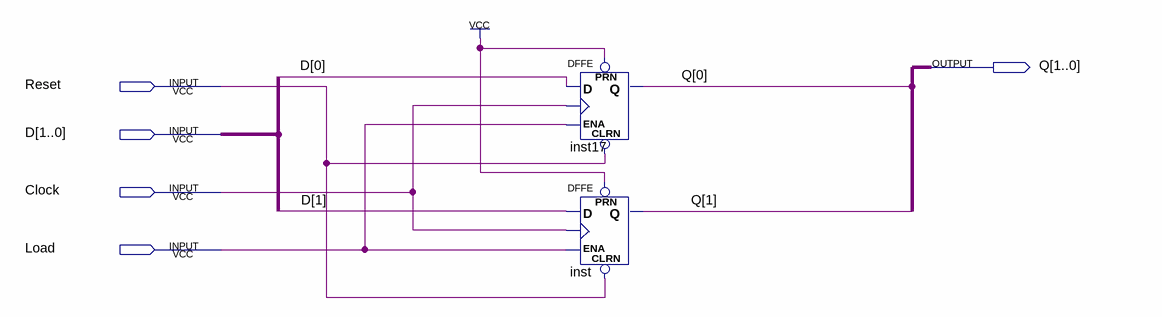
[diagram p0: schematic sheet]
// Quartus schematic ControlState.bdf as structural Verilog: 2 symbols, 5 pins
module ControlState (
  input  Reset,
  input  [1:0] D,
  input  Clock,
  input  Load,
  output [1:0] Q
);

  DFFE inst17 (.PRN(1'b1), .CLRN(Reset), .D(D[0]), .CLK(Clock), .ENA(Load), .Q(Q[0]));
  DFFE inst (.PRN(1'b1), .CLRN(Reset), .D(D[1]), .CLK(Clock), .ENA(Load), .Q(Q[1]));
endmodule
